# Altium project pay-led-v3.PrjPCB
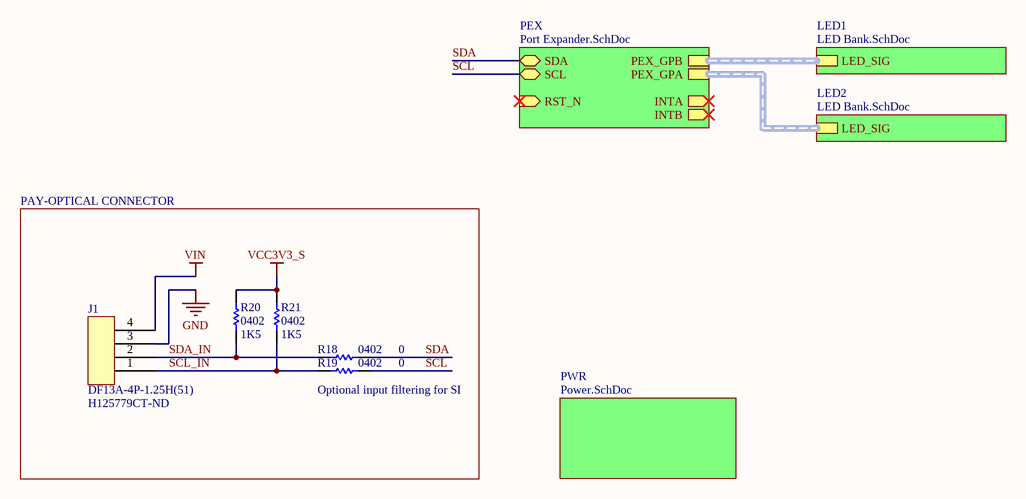
[diagram p0: TOP.SchDoc]
PROJ_AUTHOR: Dylan Vogel; PROJ_VERSION: 3.2
5 sheets, 54 parts. Net scope: hierarchical (ports join the sheet entries above them; power ports are global).
Board files: pay-led-1-v3.PcbDoc, pay-led-2-v3.PcbDoc
Sheets:
  TOP.SchDoc
    PEX = Port Expander.SchDoc
    LED1 = LED Bank.SchDoc
      LED1 = LED.SchDoc
      LED2 = LED.SchDoc
      LED3 = LED.SchDoc
      LED4 = LED.SchDoc
      LED5 = LED.SchDoc
      LED6 = LED.SchDoc
      LED7 = LED.SchDoc
      LED8 = LED.SchDoc
    LED2 = LED Bank.SchDoc
      LED1 = LED.SchDoc
      LED2 = LED.SchDoc
      LED3 = LED.SchDoc
      LED4 = LED.SchDoc
      LED5 = LED.SchDoc
      LED6 = LED.SchDoc
      LED7 = LED.SchDoc
      LED8 = LED.SchDoc
    PWR = Power.SchDoc

## Sheet TOP.SchDoc
size A4; DocumentNumber: 1; SheetNumber: 1; SheetTotal: 4

### Parts
J1  DF13A-4P-1.25H(51)  Supplier Part Number 1: H125779CT-ND  [DF13A-4P-1.25H(51)]
R18  0402  value 0  [RES0402R]
R19  0402  value 0  [RES0402R]
R20  0402  value 1K5  [RES0402R]
R21  0402  value 1K5  [RES0402R]

### Sub-sheets
LED1 = LED Bank.SchDoc: LED_SIG (harness LED_SIG)
LED2 = LED Bank.SchDoc: LED_SIG (harness LED_SIG)
PEX = Port Expander.SchDoc: PEX_GPB (harness PEX_GPB), INTB (out), PEX_GPA (harness PEX_GPA), RST_N (in), INTA (out), SCL (bidir), SDA (bidir)
PWR = Power.SchDoc: no entries

### Nets
GND: J1.3
VCC3V3_S: R20.2 R21.2
VIN: J1.4
SCL: R19.2 ; sheet PEX/SCL
SCL_IN: J1.1 R19.1 R21.1
SDA: R18.2 ; sheet PEX/SDA
SDA_IN: J1.2 R18.1 R20.1

### Buses and harness runs
harness sheet LED1/LED_SIG = sheet PEX/PEX_GPB
harness sheet LED2/LED_SIG = sheet PEX/PEX_GPA

### Notes on the sheet
- PAY-OPTICAL CONNECTOR
- (near R19) Optional input filtering for SI

### Library data of the parts
J1 = DF13A-4P-1.25H(51): 4 pos DF13 right angle surface mount connector; Supplier 1: Digi-Key
R18 R19 = RES0402: 0402 resistor; Manufacturer: Panasonic; Manufacturer Part Number: ERJ-2GE0R00X; Resistance: 0mR; Power Rating: 100mW; Voltage Rating: 50V; Tolerance: 5%; Temperature Coefficient: 600ppm/°C; Supplier 1: Digi-Key; Supplier Part Number 1: P0.0JCT-ND; Stock 1: 47740000; Pricing 1: 1=0.1, 10=0.03, 25=0.0216, 50=0.0164, 100=0.0121, 250=0.00924, 500=0.0074, 1000=0.00545, 5000=0.00391 (USD); Mount: Surface Mount; Case/Package: 0402; Case Code (Metric): 1005; Case Code (Imperial): 0402; Contact Plating: Tin; Min Operating Temperature: -55°C; Max Operating Temperature: 155°C; Packaging: Tape and Reel; Package Quantity: 1; Composition: Thick Film; Number of Terminations: 2; Termination: SMD/SMT; Military Standard: Not; Max Power Dissipation: 100mW; Voltage Rating (DC): 50V; Features: Automotive AEC-Q200; Length: 1mm; Height: 0.35mm; Width: 0.02inch; Depth: 0.5mm; Radiation Hardening: No; REACH SVHC: No SVHC; Lead Free: Lead Free; ComponentLink1URL: http://industrial.panasonic.com/www-data/pdf/AOA0000/AOA0000CE1.pdf?src-supplier=Avnet; ComponentLink1Description: http://industrial.panasonic.com/www-data/pdf/AOA0000/AOA0000CE1.pdf?src-supplier=Avnet; ComponentLink2URL: http://www.alliedelec.com/m/d/51cd0790071e1666bdb9d00c57fcf960.pdf?src-supplier=Allied+Electronics; ComponentLink2Description: http://www.alliedelec.com/m/d/51cd0790071e1666bdb9d00c57fcf960.pdf?src-supplier=Allied+Electronics; ComponentLink3URL: http://industrial.panasonic.com/www-data/pdf/AOA0000/AOA0000CE1.pdf?src-supplier=Avnet+Europe; ComponentLink3Description: http://industrial.panasonic.com/www-data/pdf/AOA0000/AOA0000CE1.pdf?src-supplier=Avnet+Europe; ComponentLink4URL: http://www.farnell.com/datasheets/2059623.pdf?src-supplier=Farnell; ComponentLink4Description: http://www.farnell.com/datasheets/2059623.pdf?src-supplier=Farnell; ComponentLink5URL: http://www.farnell.com/datasheets/2059623.pdf?src-supplier=Element14; ComponentLink5Description: http://www.farnell.com/datasheets/2059623.pdf?src-supplier=Element14; ComponentLink6URL: http://www.farnell.com/datasheets/1678796.pdf?src-supplier=Element14; ComponentLink6Description: http://www.farnell.com/datasheets/1678796.pdf?src-supplier=Element14
R20 R21 = RES0402: 0402 resistor

## Sheet Port Expander.SchDoc
size A4; DocumentNumber: 3; SheetNumber: 3; SheetTotal: 4
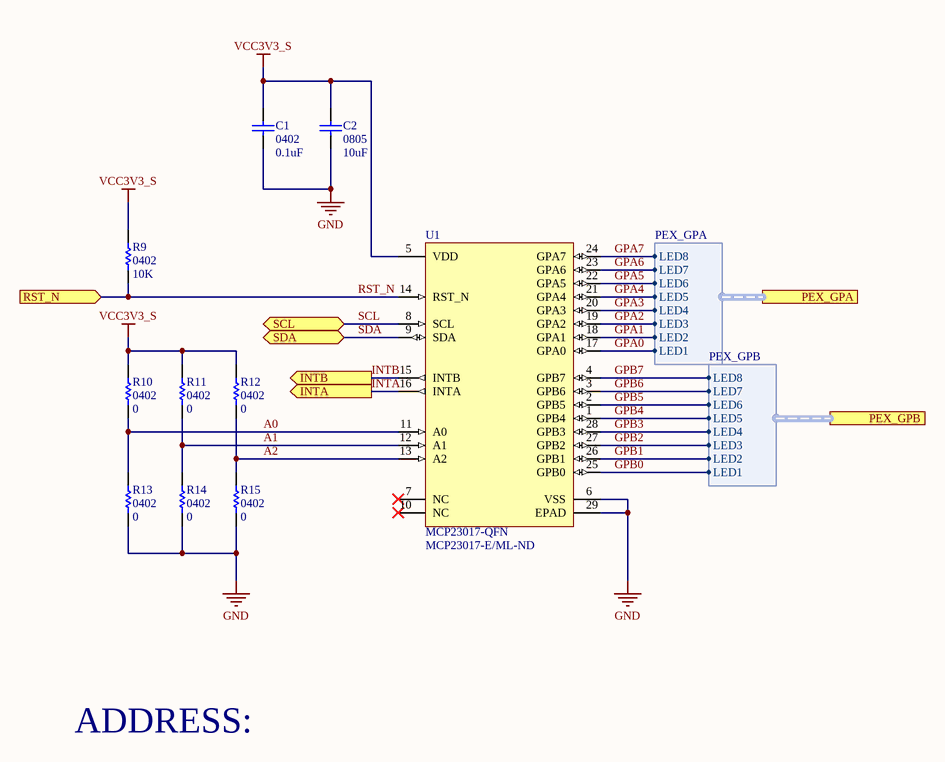
[diagram p1: Port Expander.SchDoc]

### Parts
C1  0402  value 0.1uF  [CAP0402R]
C2  0805  value 10uF  [CAP0805R]
R9  0402  value 10K  [RES0402R]
R10  0402  value 0  [RES0402R]
R11  0402  value 0  [RES0402R]
R12  0402  value 0  [RES0402R]
R13  0402  value 0  [RES0402R]
R14  0402  value 0  [RES0402R]
R15  0402  value 0  [RES0402R]
U1  MCP23017-QFN  Supplier Part Number 1: MCP23017-E/ML-ND  [QFN65P600X600X100-29]

### Ports
INTA (out), INTB (out), PEX_GPA (harness PEX_GPA), PEX_GPB (harness PEX_GPB), RST_N (in), SCL (bidir), SDA (bidir)

### Harnesses
PEX_GPA: LED1, LED2, LED3, LED4, LED5, LED6, LED7, LED8
PEX_GPB: LED1, LED2, LED3, LED4, LED5, LED6, LED7, LED8

### Nets
GND: C1.1 C2.1 R13.1 R14.1 R15.1 U1.6(VSS) U1.29(EPAD)
VCC3V3_S: C1.2 C2.2 R9.2 R10.2 R11.2 R12.2 U1.5(VDD)
A0: R10.1 R13.2 U1.11(A0)
A1: R11.1 R14.2 U1.12(A1)
A2: R12.1 R15.2 U1.13(A2)
GPA0: U1.17(GPA0) ; port PEX_GPA.LED1
GPA1: U1.18(GPA1) ; port PEX_GPA.LED2
GPA2: U1.19(GPA2) ; port PEX_GPA.LED3
GPA3: U1.20(GPA3) ; port PEX_GPA.LED4
GPA4: U1.21(GPA4) ; port PEX_GPA.LED5
GPA5: U1.22(GPA5) ; port PEX_GPA.LED6
GPA6: U1.23(GPA6) ; port PEX_GPA.LED7
GPA7: U1.24(GPA7) ; port PEX_GPA.LED8
GPB0: U1.25(GPB0) ; port PEX_GPB.LED1
GPB1: U1.26(GPB1) ; port PEX_GPB.LED2
GPB2: U1.27(GPB2) ; port PEX_GPB.LED3
GPB3: U1.28(GPB3) ; port PEX_GPB.LED4
GPB4: U1.1(GPB4) ; port PEX_GPB.LED5
GPB5: U1.2(GPB5) ; port PEX_GPB.LED6
GPB6: U1.3(GPB6) ; port PEX_GPB.LED7
GPB7: U1.4(GPB7) ; port PEX_GPB.LED8
INTA: U1.16(INTA) ; port INTA
INTB: U1.15(INTB) ; port INTB
RST_N: R9.1 U1.14(RST_N) ; port RST_N
SCL: U1.8(SCL) ; port SCL
SDA: U1.9(SDA) ; port SDA

Not connected (* = marked no-connect by the designer): U1 7(NC)* 10(NC)*

### Notes on the sheet
- ADDRESS:

### Library data of the parts
C1 = CAP0402: 0402 capacitor; Manufacturer: Taiyo Yuden; Manufacturer Part Number: EMK105B7104KVHF; Voltage Rating: 16V; Capacitance: 100nF; Tolerance: 10%; Dielectric: X7R; Supplier 1: Digi-Key; Supplier Part Number 1: 587-3807-1-ND; Stock 1: 18196; Pricing 1: 1=0.1, 10=0.057, 100=0.0254, 500=0.01812, 1000=0.01423, 2500=0.01294, 5000=0.0119 (USD); Mount: Surface Mount; Case/Package: 0402; Weight: 2.3E-05oz; Case Code (Metric): 1005; Case Code (Imperial): 0402; Min Operating Temperature: -55°C; Max Operating Temperature: 125°C; Package Quantity: 10000; Packaging: Tape and Reel; Termination: SMD/SMT; Voltage Rating (DC): 16V; Length: 0.039inch; Height: 0.5mm; Width: 0.02inch; Thickness: 0.022inch; Ratings: AEC-Q200; Lead Free: Lead Free; Halogen Free: Halogen Free
C2 = CAP0805: 0805 capacitor; Manufacturer: Murata; Manufacturer Part Number: GCM21BR70J106KE22K; Tolerance: 10%; Dielectric: X7R; Voltage Rating (DC): 6.3V; Supplier 1: Digi-Key; Supplier Part Number 1: 490-14361-1-ND; Stock 1: 214938; Pricing 1: 1=0.42, 10=0.29, 100=0.1742, 500=0.13064, 1000=0.11031, 2500=0.10451, 5000=0.0987 (USD); Case/Package: 0805; Min Operating Temperature: -55°C; Max Operating Temperature: 125°C; Capacitance: 10uF; Packaging: Tape and Reel; Length: 2mm; Depth: 1.25mm; Lead Free: Lead Free
R9 = RES0402: 0402 resistor; Manufacturer: Panasonic; Manufacturer Part Number: ERJ-2RKF1002X; Resistance: 10kR; Power Rating: 100mW; Tolerance: 1%; Voltage Rating: 50V; Temperature Coefficient: 100ppm/°C; Supplier 1: Digi-Key; Supplier Part Number 1: P10.0KLCT-ND; Stock 1: 14350001; Pricing 1: 1=0.1, 10=0.045, 100=0.0183, 1000=0.00823, 2500=0.00715, 5000=0.0059 (USD); Mount: Surface Mount; Case/Package: 0402; Number of Pins: 2; Case Code (Metric): 1005; Case Code (Imperial): 0402; Contact Plating: Tin; Min Operating Temperature: -55°C; Max Operating Temperature: 155°C; Packaging: Tape and Reel; Package Quantity: 1; Composition: Thick Film; Number of Terminations: 2; Termination: SMD/SMT; Military Standard: Not; Max Power Dissipation: 100mW; Voltage Rating (DC): 50V; Features: Automotive AEC-Q200; Length: 1mm; Height: 0.35mm; Width: 0.02inch; Depth: 0.5mm; Radiation Hardening: No; REACH SVHC: No SVHC; Lead Free: Lead Free; ComponentLink1URL: http://industrial.panasonic.com/www-data/pdf/AOA0000/AOA0000CE2.pdf?src-supplier=Future+Electronics; ComponentLink1Description: http://industrial.panasonic.com/www-data/pdf/AOA0000/AOA0000CE2.pdf?src-supplier=Future+Electronics; ComponentLink2URL: http://industrial.panasonic.com/www-data/pdf/AOA0000/AOA0000CE2.pdf?src-supplier=Avnet+Europe; ComponentLink2Description: http://industrial.panasonic.com/www-data/pdf/AOA0000/AOA0000CE2.pdf?src-supplier=Avnet+Europe; ComponentLink3URL: https://industrial.panasonic.com/cdbs/www-data/pdf/RDA0000/DMA0000COL11.pdf?src-supplier=Mouser; ComponentLink3Description: https://industrial.panasonic.com/cdbs/www-data/pdf/RDA0000/DMA0000COL11.pdf?src-supplier=Mouser; ComponentLink4URL: http://www.farnell.com/datasheets/1678782.pdf?src-supplier=Element14; ComponentLink4Description: http://www.farnell.com/datasheets/1678782.pdf?src-supplier=Element14; ComponentLink5URL: http://www.farnell.com/datasheets/1911175.pdf?src-supplier=Farnell; ComponentLink5Description: http://www.farnell.com/datasheets/1911175.pdf?src-supplier=Farnell; ComponentLink6URL: http://www.jameco.com/Jameco/Products/ProdDS/1987020.pdf?src-supplier=Jameco; ComponentLink6Description: http://www.jameco.com/Jameco/Products/ProdDS/1987020.pdf?src-supplier=Jameco; ComponentLink7URL: http://industrial.panasonic.com/www-data/pdf/AOA0000/AOA0000CE2.pdf?src-supplier=Avnet; ComponentLink7Description: http://industrial.panasonic.com/www-data/pdf/AOA0000/AOA0000CE2.pdf?src-supplier=Avnet; ComponentLink8URL: http://www.alliedelec.com/m/d/623f45ff1957d936ff56d46fd1c28cac.pdf?src-supplier=Allied+Electronics; ComponentLink8Description: http://www.alliedelec.com/m/d/623f45ff1957d936ff56d46fd1c28cac.pdf?src-supplier=Allied+Electronics
R10-R15 = RES0402: as R18 on sheet TOP; Supplier 1: Digi-Key; Supplier Part Number 1: P0.0JCT-ND; Stock 1: 47740000; Pricing 1: 1=0.1, 10=0.03, 25=0.0216, 50=0.0164, 100=0.0121, 250=0.00924, 500=0.0074, 1000=0.00545, 5000=0.00391 (USD); Mount: Surface Mount; Case/Package: 0402; Case Code (Metric): 1005; Case Code (Imperial): 0402; Contact Plating: Tin; Min Operating Temperature: -55°C; Max Operating Temperature: 155°C; Packaging: Tape and Reel; Package Quantity: 1; Composition: Thick Film; Number of Terminations: 2; Termination: SMD/SMT; Military Standard: Not; Max Power Dissipation: 100mW; Voltage Rating (DC): 50V; Features: Automotive AEC-Q200; Length: 1mm; Height: 0.35mm; Width: 0.02inch; Depth: 0.5mm; Radiation Hardening: No; REACH SVHC: No SVHC; Lead Free: Lead Free; ComponentLink1URL: http://industrial.panasonic.com/www-data/pdf/AOA0000/AOA0000CE1.pdf?src-supplier=Avnet; ComponentLink1Description: http://industrial.panasonic.com/www-data/pdf/AOA0000/AOA0000CE1.pdf?src-supplier=Avnet; ComponentLink2URL: http://www.alliedelec.com/m/d/51cd0790071e1666bdb9d00c57fcf960.pdf?src-supplier=Allied+Electronics; ComponentLink2Description: http://www.alliedelec.com/m/d/51cd0790071e1666bdb9d00c57fcf960.pdf?src-supplier=Allied+Electronics; ComponentLink3URL: http://industrial.panasonic.com/www-data/pdf/AOA0000/AOA0000CE1.pdf?src-supplier=Avnet+Europe; ComponentLink3Description: http://industrial.panasonic.com/www-data/pdf/AOA0000/AOA0000CE1.pdf?src-supplier=Avnet+Europe; ComponentLink4URL: http://www.farnell.com/datasheets/2059623.pdf?src-supplier=Farnell; ComponentLink4Description: http://www.farnell.com/datasheets/2059623.pdf?src-supplier=Farnell; ComponentLink5URL: http://www.farnell.com/datasheets/2059623.pdf?src-supplier=Element14; ComponentLink5Description: http://www.farnell.com/datasheets/2059623.pdf?src-supplier=Element14; ComponentLink6URL: http://www.farnell.com/datasheets/1678796.pdf?src-supplier=Element14; ComponentLink6Description: http://www.farnell.com/datasheets/1678796.pdf?src-supplier=Element14
U1 = MCP23017-QFN: Supplier 1: Digi-Key

## Sheet LED Bank.SchDoc
size A4; DocumentNumber: 4; SheetNumber: 4; SheetTotal: 4
Used 2 times, as channels LED1, LED2. Parts and nets are listed once, with the designators drawn on the sheet.
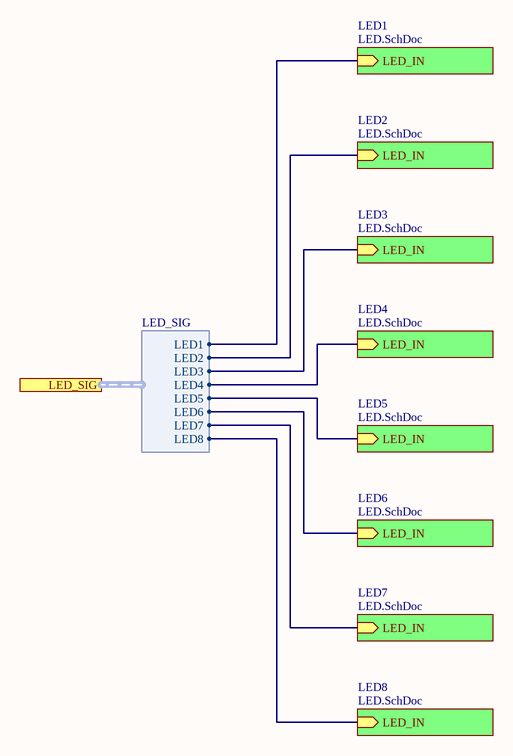
[diagram p2: LED Bank.SchDoc]

### Sub-sheets
LED1 = LED.SchDoc: LED_IN (in)
LED2 = LED.SchDoc: LED_IN (in)
LED3 = LED.SchDoc: LED_IN (in)
LED4 = LED.SchDoc: LED_IN (in)
LED5 = LED.SchDoc: LED_IN (in)
LED6 = LED.SchDoc: LED_IN (in)
LED7 = LED.SchDoc: LED_IN (in)
LED8 = LED.SchDoc: LED_IN (in)

### Ports
LED_SIG (harness LED_SIG)

### Harnesses
LED_SIG: LED1, LED2, LED3, LED4, LED5, LED6, LED7, LED8

### Nets
(unnamed): sheet LED1/LED_IN, port LED_SIG.LED1
(unnamed): sheet LED2/LED_IN, port LED_SIG.LED2
(unnamed): sheet LED3/LED_IN, port LED_SIG.LED3
(unnamed): sheet LED4/LED_IN, port LED_SIG.LED4
(unnamed): sheet LED5/LED_IN, port LED_SIG.LED5
(unnamed): sheet LED6/LED_IN, port LED_SIG.LED6
(unnamed): sheet LED7/LED_IN, port LED_SIG.LED7
(unnamed): sheet LED8/LED_IN, port LED_SIG.LED8

### Channels
LED1: no parts or ports
LED2: no parts or ports

## Sheet LED.SchDoc
size A4
Used 16 times, as channels LED1/LED1, LED1/LED2, LED1/LED3, LED1/LED4, LED1/LED5, LED1/LED6, LED1/LED7, LED1/LED8, LED2/LED1, LED2/LED2, LED2/LED3, LED2/LED4, LED2/LED5, LED2/LED6, LED2/LED7, LED2/LED8. Parts and nets are listed once, with the designators drawn on the sheet.
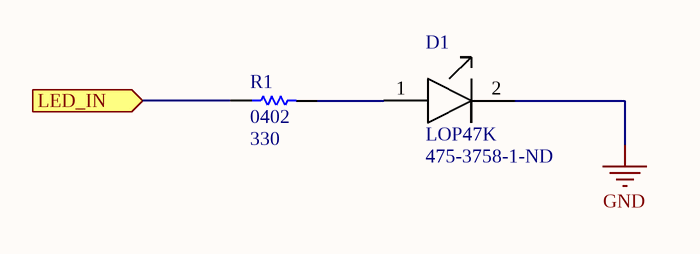
[diagram p3: LED.SchDoc]

### Parts
D1  LOP47K  Supplier Part Number 1: 475-3758-1-ND  [LB P4SG]
R1  0402  value 330  [RES0402R]

### Ports
LED_IN (in)

### Nets
GND: D1.2(Cathode)
LED_IN: R1.1 ; port LED_IN
NetD1_1: D1.1(Anode) R1.2

### Channels
LED1/LED1: designators end in _LED11; ports LED_IN=GPB0
LED1/LED2: designators end in _LED21; ports LED_IN=GPB1
LED1/LED3: designators end in _LED31; ports LED_IN=GPB2
LED1/LED4: designators end in _LED41; ports LED_IN=GPB3
LED1/LED5: designators end in _LED51; ports LED_IN=GPB4
LED1/LED6: designators end in _LED61; ports LED_IN=GPB5
LED1/LED7: designators end in _LED71; ports LED_IN=GPB6
LED1/LED8: designators end in _LED81; ports LED_IN=GPB7
LED2/LED1: designators end in _LED12; ports LED_IN=GPA0
LED2/LED2: designators end in _LED22; ports LED_IN=GPA1
LED2/LED3: designators end in _LED32; ports LED_IN=GPA2
LED2/LED4: designators end in _LED42; ports LED_IN=GPA3
LED2/LED5: designators end in _LED52; ports LED_IN=GPA4
LED2/LED6: designators end in _LED62; ports LED_IN=GPA5
LED2/LED7: designators end in _LED72; ports LED_IN=GPA6
LED2/LED8: designators end in _LED82; ports LED_IN=GPA7

### Library data of the parts
D1 = LO P47K: LED ORANGE CLEAR SMD BOTTOM ENTRY; Supplier 1: Digi-Key
R1 = RES0402: 0402 resistor; Manufacturer: TE Connectivity; Manufacturer Part Number: CRGCQ0402F330R; Resistance: 330R; Tolerance: 1%; Max Power Dissipation: 63mW; Temperature Coefficient: 100ppm/°C; Supplier 1: Digi-Key; Supplier Part Number 1: A129621CT-ND; Stock 1: 224275; Pricing 1: 1=0.1, 10=0.022, 100=0.009, 1000=0.00406, 2500=0.00352, 5000=0.00291 (USD); Case/Package: 0402; Case Code (Imperial): 0402; Case Code (Metric): 1005; Min Operating Temperature: -55°C; Max Operating Temperature: 155°C; Composition: Thick Film; Features: Moisture Resistant,Automotive AEC-Q200; Packaging: Tape and Reel; Number of Terminations: 2

## Sheet Power.SchDoc
size A4; DocumentNumber: 2; SheetNumber: 2; SheetTotal: 4
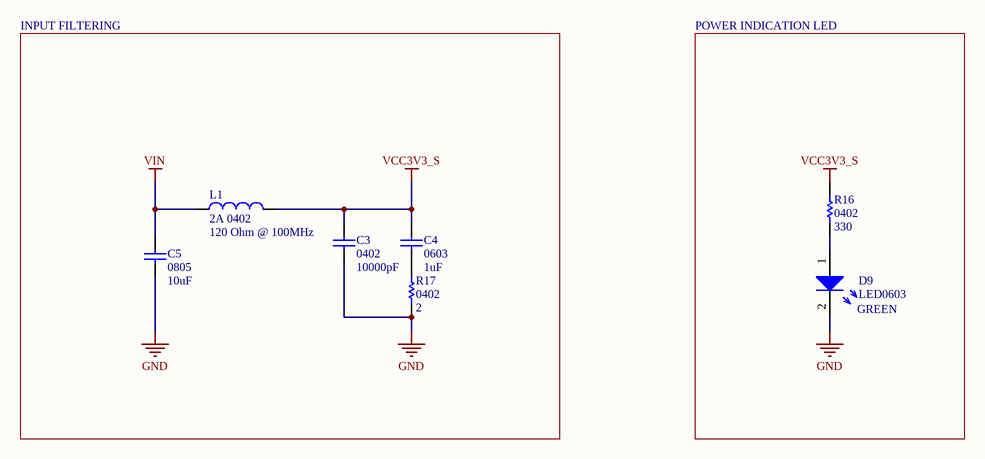
[diagram p4: Power.SchDoc]

### Parts
C3  0402  value 10000pF  [CAP0402R]
C4  0603  value 1uF  [CAP0603R]
C5  0805  value 10uF  [CAP0805R]
D9  LED0603  Colour: GREEN  [LED0603]
L1  2A 0402  value 120 Ohm @ 100MHz  [RES0402R]
R16  0402  value 330  [RES0402R]
R17  0402  value 2  [RES0402R]

### Blocks framed on the sheet
INPUT FILTERING: C3-C5 L1 R17
POWER INDICATION LED: D9 R16

### Nets
GND: C3.1 C5.1 D9.2 R17.1
VCC3V3_S: C3.2 C4.2 L1.2 R16.2
VIN: C5.2 L1.1
NetC4_1: C4.1 R17.2
NetD9_1: D9.1 R16.1

### Library data of the parts
C3 = CAP0402: 0402 capacitor; Manufacturer: Murata; Manufacturer Part Number: GCM155R71H103KA55D; Capacitance: 10nF; Tolerance: 10%; Voltage Rating: 50V; Dielectric: X7R; Supplier 1: Digi-Key; Supplier Part Number 1: 490-4762-1-ND; Stock 1: 23977554; Pricing 1: 1=0.1, 10=0.042, 100=0.0188, 500=0.01344, 1000=0.01056, 2500=0.0096, 5000=0.00883 (USD); Mount: Surface Mount; Case/Package: 0402; Case Code (Imperial): 0402; Case Code (Metric): 1005; Min Operating Temperature: -55°C; Max Operating Temperature: 125°C; Packaging: Tape and Reel; Package Quantity: 1; Termination: SMD/SMT; Voltage: 50V; Voltage Rating (DC): 50V; Length: 1mm; Height: 0.5mm; Width: 0.02inch; Thickness: 0.022inch; Depth: 0.5mm; Ratings: AEC-Q200; Radiation Hardening: No; REACH SVHC: No SVHC; Lead Free: Lead Free; ComponentLink1URL: http://psearch.murata.com/capacitor/product/GCM155R71H103KA55%23.pdf?src-supplier=Future+Electronics; ComponentLink1Description: http://psearch.murata.com/capacitor/product/GCM155R71H103KA55%23.pdf?src-supplier=Future+Electronics; ComponentLink2URL: https://www.verical.com/server-webapp/html/getDatasheet?partID=27433&src-supplier=Verical; ComponentLink2Description: https://www.verical.com/server-webapp/html/getDatasheet?partID=27433&src-supplier=Verical; ComponentLink3URL: http://psearch.en.murata.com/capacitor/product/GCM155R71H103KA55%23.pdf?src-supplier=Avnet; ComponentLink3Description: http://psearch.en.murata.com/capacitor/product/GCM155R71H103KA55%23.pdf?src-supplier=Avnet; ComponentLink4URL: http://psearch.murata.com/capacitor/product/GCM155R71H103KA55%23.pdf?src-supplier=Avnet+Europe; ComponentLink4Description: http://psearch.murata.com/capacitor/product/GCM155R71H103KA55%23.pdf?src-supplier=Avnet+Europe; ComponentLink5URL: http://search.murata.co.jp/Ceramy/image/img/A01X/partnumbering_e_02.pdf?src-supplier=Digi-Key; ComponentLink5Description: http://search.murata.co.jp/Ceramy/image/img/A01X/partnumbering_e_02.pdf?src-supplier=Digi-Key; ComponentLink6URL: http://uk.rs-online.com/webdocs/0ef9/0900766b80ef92d0.pdf?src-supplier=RSComponents; ComponentLink6Description: http://uk.rs-online.com/webdocs/0ef9/0900766b80ef92d0.pdf?src-supplier=RSComponents
C4 = CAP0603: 0603 capacitor; Manufacturer: KEMET; Manufacturer Part Number: C0603C105K4RACAUTO; Tolerance: 10%; Voltage Rating: 16V; Supplier 1: Digi-Key; Supplier Part Number 1: 399-17704-1-ND; Stock 1: 376276; Pricing 1: 1=0.17, 10=0.12, 100=0.0564, 500=0.03952, 1000=0.03273 (USD); Mount: Surface Mount; Case/Package: 0603; Case Code (Imperial): 0603; Case Code (Metric): 1608; Min Operating Temperature: -55°C; Max Operating Temperature: 125°C; Packaging: Cut Tape; Capacitance: 1uF; Ratings: AEC-Q200
C5 = CAP0805: as C2 on sheet Port Expander; Supplier 1: Digi-Key; Supplier Part Number 1: 490-14361-1-ND; Stock 1: 214938; Pricing 1: 1=0.42, 10=0.29, 100=0.1742, 500=0.13064, 1000=0.11031, 2500=0.10451, 5000=0.0987 (USD); Case/Package: 0805; Min Operating Temperature: -55°C; Max Operating Temperature: 125°C; Capacitance: 10uF; Packaging: Tape and Reel; Length: 2mm; Depth: 1.25mm; Lead Free: Lead Free
D9 = LED0603: Generic 0603 LED. Use ChipLED from Osram for generic ones.; Manufacturer: Osram Opto; Manufacturer Part Number: LTQ39G-Q1OO-25-1; Lens Style: Diffused,Colorless,Rectangular; Luminous Intensity: 280mcd; Forward Current: 15mA; Forward Voltage: 3.2V; Dominant Wavelength: 530nm; Luminous Flux: 0.55lm; Test Current: 5mA; Number of Elements: 1; Reverse Voltage: 5V; Supplier 1: Digi-Key; Supplier Part Number 1: 475-3442-1-ND; Stock 1: 27630; Pricing 1: 1=0.45, 10=0.327, 25=0.2668, 100=0.2134, 250=0.18004, 500=0.15336, 1000=0.12002 (USD); Mount: Surface Mount; Case/Package: SMD/SMT; Number of Pins: 2; Color: Green; Min Operating Temperature: -40°C; Max Operating Temperature: 85°C; Packaging: Tape and Reel; Number of LEDs: 1; Length: 1.7mm; Depth: 0.9mm; Radiation Hardening: No
L1 = Inductor: Manufacturer: Murata; Manufacturer Part Number: BLM15PX121SZ1D; Code_IEC: 1005; Number of Lines: 1; DC Resistance (DCR): 55mR; Published: 8-Jun-2000; LatestRevisionDate: 29-May-2009; LatestRevisionNote: IPC-7351 Footprint Added.; PackageReference: 0402-A; Publisher: Altium Limited; PackageDescription: Chip Inductor; Code_JEITA: 0402; Supplier 1: Digi-Key; Supplier Part Number 1: 490-16505-1-ND; Stock 1: 18936; Pricing 1: 1=0.15, 10=0.125, 25=0.0972, 50=0.0804, 100=0.0693, 250=0.05544, 500=0.0499, 1000=0.04158, 5000=0.03881 (USD); Mount: Surface Mount; Case/Package: 0402; Case Code (Imperial): 0402; Case Code (Metric): 1005; Min Operating Temperature: -55°C; Max Operating Temperature: 125°C; Packaging: Cut Tape; Max Current Rating: 2A; Ratings: AEC-Q200
R16 = RES0402: as R1 on sheet LED; Supplier 1: Digi-Key; Supplier Part Number 1: A129621CT-ND; Stock 1: 224275; Pricing 1: 1=0.1, 10=0.022, 100=0.009, 1000=0.00406, 2500=0.00352, 5000=0.00291 (USD); Case/Package: 0402; Case Code (Imperial): 0402; Case Code (Metric): 1005; Min Operating Temperature: -55°C; Max Operating Temperature: 155°C; Composition: Thick Film; Features: Moisture Resistant,Automotive AEC-Q200; Packaging: Tape and Reel; Number of Terminations: 2
R17 = RES0402: 0402 resistor; Manufacturer: Yageo; Manufacturer Part Number: AC0402FR-072RL; Resistance: 2R; Tolerance: 1%; Max Power Dissipation: 63mW; Temperature Coefficient: 200ppm/°C; Supplier 1: Digi-Key; Supplier Part Number 1: YAG3472CT-ND; Stock 1: 17701; Pricing 1: 1=0.1, 10=0.03, 100=0.012, 1000=0.0054, 2500=0.00468, 5000=0.00387 (USD); Case/Package: 0402; Case Code (Metric): 1005; Case Code (Imperial): 0402; Min Operating Temperature: -55°C; Max Operating Temperature: 155°C; Packaging: Tape and Reel; Composition: Thick Film; Number of Terminations: 2; Features: Moisture Resistant,Automotive AEC-Q200; Length: 0.039inch; Height: 0.015inch; Width: 0.02inch

## Nets that join several sheets
GND: TOP (J1.3), Port Expander (7 pins), LED1/LED1 (D1_LED11.2), LED1/LED2 (D1_LED21.2), LED1/LED3 (D1_LED31.2), LED1/LED4 (D1_LED41.2), LED1/LED5 (D1_LED51.2), LED1/LED6 (D1_LED61.2), LED1/LED7 (D1_LED71.2), LED1/LED8 (D1_LED81.2), LED2/LED1 (D1_LED12.2), LED2/LED2 (D1_LED22.2), LED2/LED3 (D1_LED32.2), LED2/LED4 (D1_LED42.2), LED2/LED5 (D1_LED52.2), LED2/LED6 (D1_LED62.2), LED2/LED7 (D1_LED72.2), LED2/LED8 (D1_LED82.2), Power (C3.1 C5.1 D9.2 R17.1)
VCC3V3_S: TOP (R20.2 R21.2), Port Expander (7 pins), Power (C3.2 C4.2 L1.2 R16.2)
VIN: TOP (J1.4), Power (C5.2 L1.1)
GPA0: Port Expander (U1.17), LED2/LED1 (R1_LED12.1)
GPA1: Port Expander (U1.18), LED2/LED2 (R1_LED22.1)
GPA2: Port Expander (U1.19), LED2/LED3 (R1_LED32.1)
GPA3: Port Expander (U1.20), LED2/LED4 (R1_LED42.1)
GPA4: Port Expander (U1.21), LED2/LED5 (R1_LED52.1)
GPA5: Port Expander (U1.22), LED2/LED6 (R1_LED62.1)
GPA6: Port Expander (U1.23), LED2/LED7 (R1_LED72.1)
GPA7: Port Expander (U1.24), LED2/LED8 (R1_LED82.1)
GPB0: Port Expander (U1.25), LED1/LED1 (R1_LED11.1)
GPB1: Port Expander (U1.26), LED1/LED2 (R1_LED21.1)
GPB2: Port Expander (U1.27), LED1/LED3 (R1_LED31.1)
GPB3: Port Expander (U1.28), LED1/LED4 (R1_LED41.1)
GPB4: Port Expander (U1.1), LED1/LED5 (R1_LED51.1)
GPB5: Port Expander (U1.2), LED1/LED6 (R1_LED61.1)
GPB6: Port Expander (U1.3), LED1/LED7 (R1_LED71.1)
GPB7: Port Expander (U1.4), LED1/LED8 (R1_LED81.1)
SCL: TOP (R19.2), Port Expander (U1.8)
SDA: TOP (R18.2), Port Expander (U1.9)

## Assembly variants
pay-led-2: all parts fitted
pay-led-1: all parts fitted